# Altium schematic sheet Copy of EE209_Schematic.SchDoc: Wireless Energy Monitor
size A3; Author: Team XX; Organization: EE/CS 209 Class of 2022; Address1: Department of ECSE; Address2: The University of Auckland; Address3: 20 Symonds Street; Address4: Auckland, NZ; Revision: 1.0; SheetNumber: 1; SheetTotal: 1
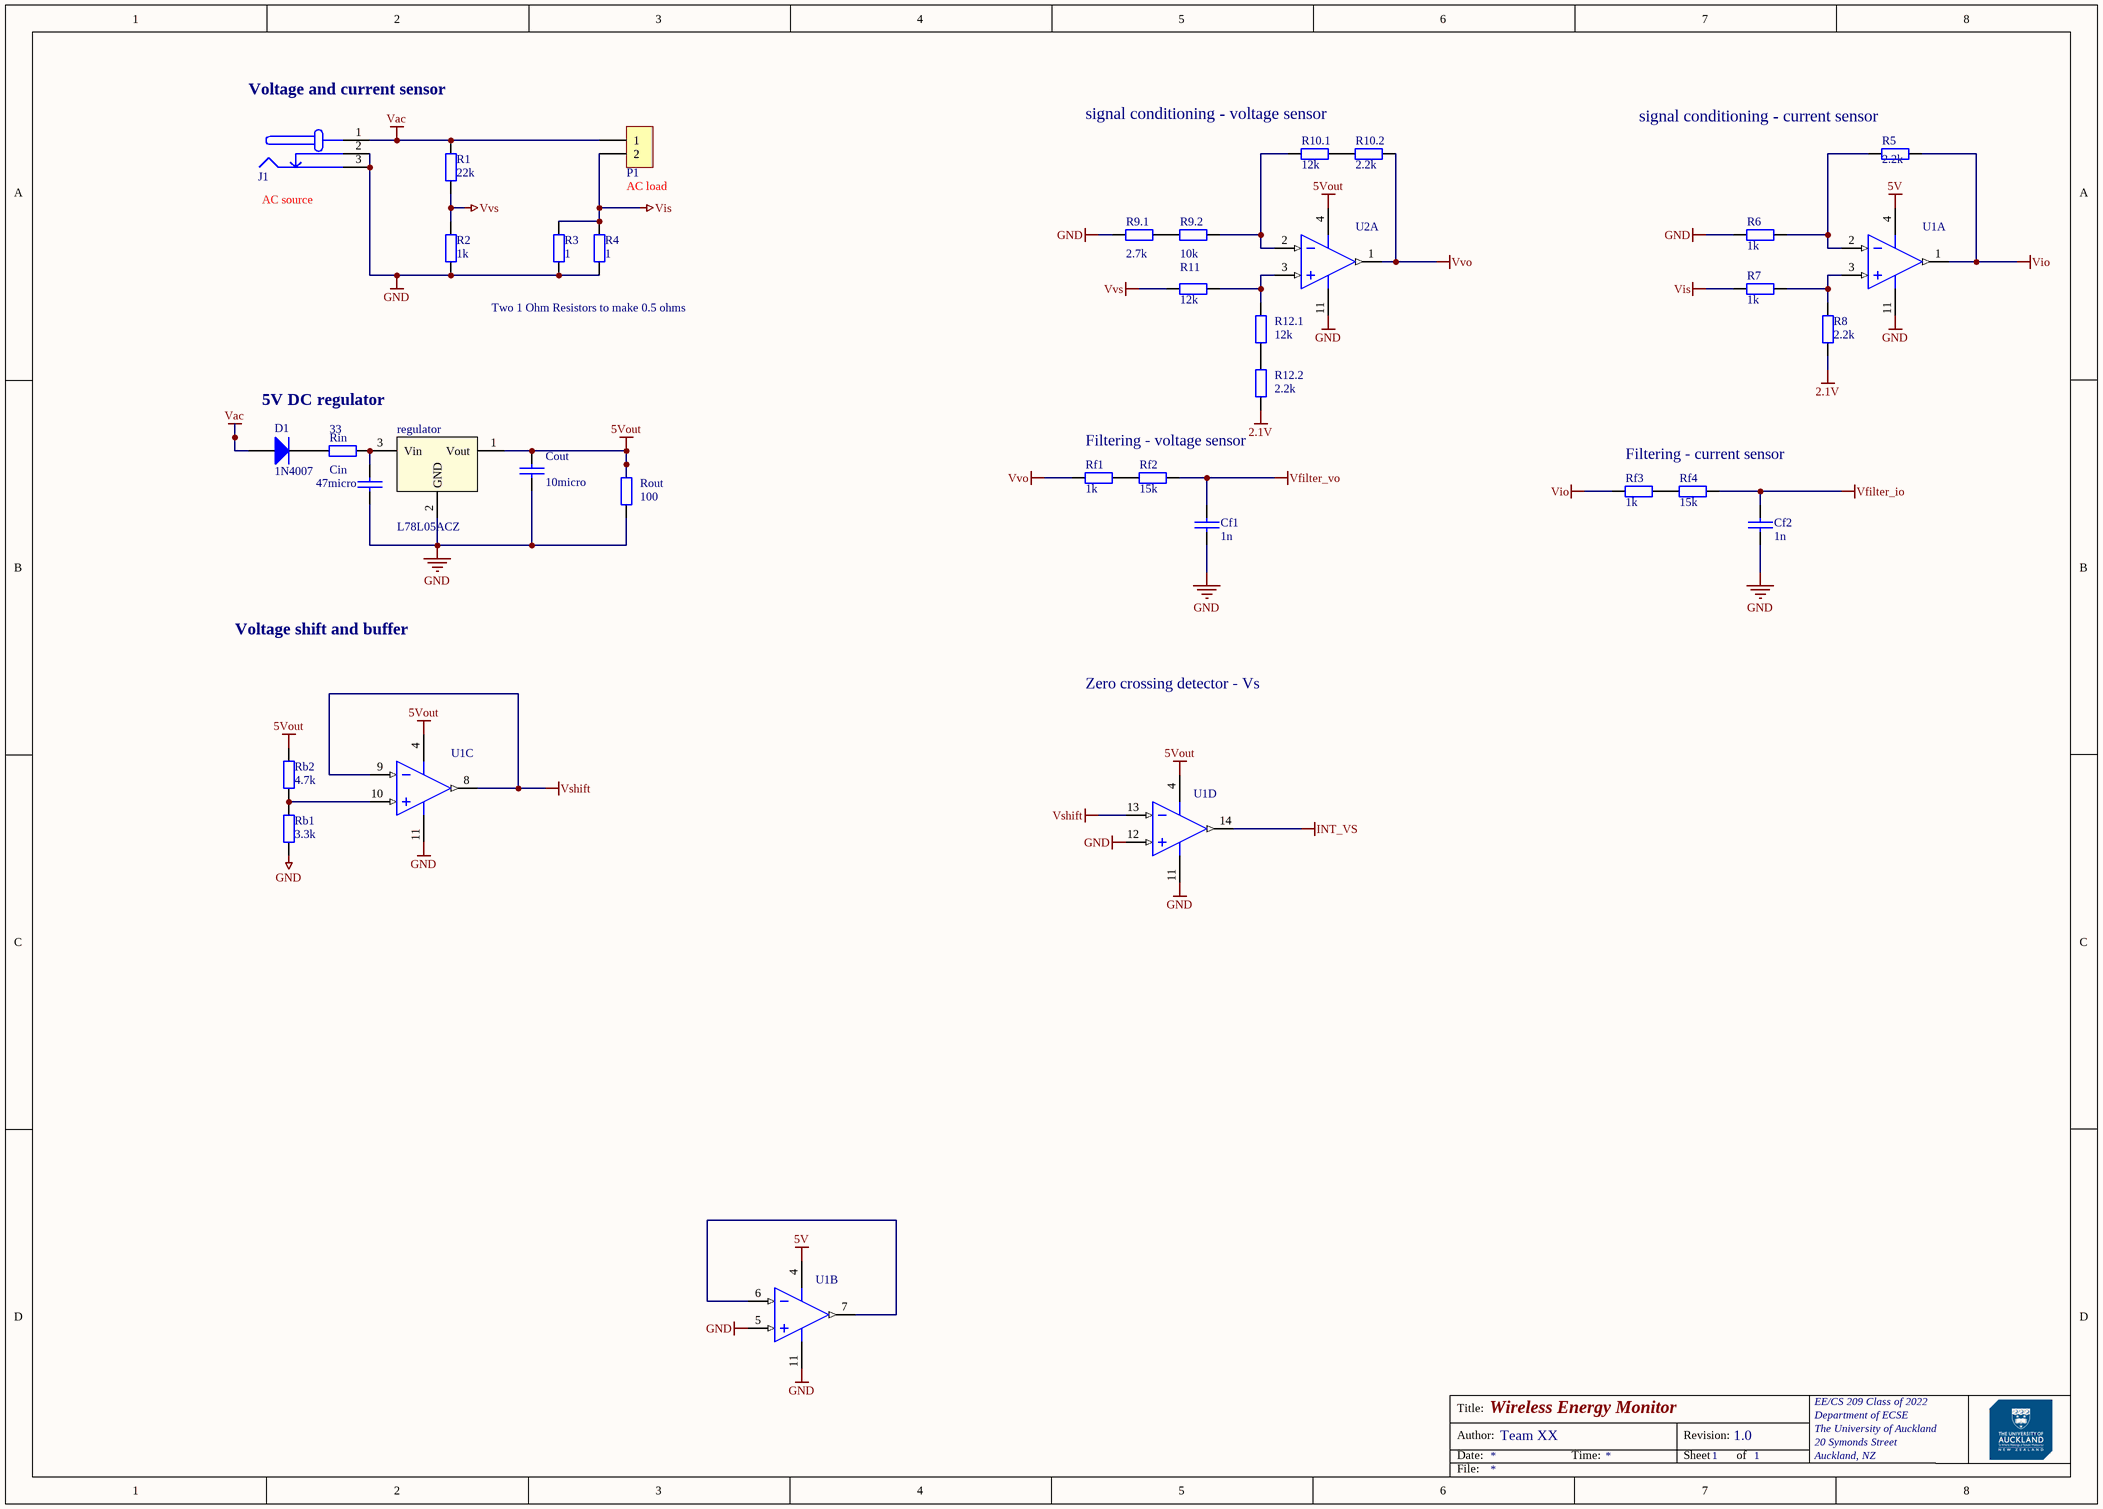
[diagram p0: Copy of EE209_Schematic.SchDoc]

## Parts
Cf1  1n  [CCAP-5P0]
Cf2  1n  [CCAP-5P0]
Cin  47micro  [CCAP-5P0]
Cout  10micro  [CCAP-5P0]
D1  1N4007  [1N4007-MFG]
J1  DC barrel jack  [AC-Socket]  (value not drawn)
P1  Dual Banana Plugs  [Dual Banana Plug]  (value not drawn)
R1  22k  [AXIAL-0.4]
R2  1k  [AXIAL-0.4]
R3  1  [AXIAL-0.4]
R4  1  [AXIAL-0.4]
R5  2.2k  [AXIAL-0.4]
R6  1k  [AXIAL-0.4]
R7  1k  [AXIAL-0.4]
R8  2.2k  [AXIAL-0.4]
R9.1  2.7k  [AXIAL-0.4]
R9.2  10k  [AXIAL-0.4]
R10.1  12k  [AXIAL-0.4]
R10.2  2.2k  [AXIAL-0.4]
R11  12k  [AXIAL-0.4]
R12.1  12k  [AXIAL-0.4]
R12.2  2.2k  [AXIAL-0.4]
Rb1  3.3k  [AXIAL-0.4]
Rb2  4.7k  [AXIAL-0.4]
regulator  L78L05ACZ  [TO-92]
Rf1  1k  [AXIAL-0.4]
Rf2  15k  [AXIAL-0.4]
Rf3  1k  [AXIAL-0.4]
Rf4  15k  [AXIAL-0.4]
Rin  33  [AXIAL-0.4]
Rout  100  [AXIAL-0.4]
U1  LM324  [DIP-14]  (value not drawn)  (parts A,B,C,D of 4)
U2  LM324  [DIP-14]  (value not drawn)  (part A of 4)

## Nets
2.1V: R8.1 R12.2.1
5V: U1.4(VDD)
5Vout: Cout.1 Rb2.2 regulator.1(Vout) Rout.2 U1.4(VDD) U2.4(VDD)
GND: Cf1.2 Cf2.2 Cin.2 Cout.2 J1.2(GND_ALT) J1.3(GND) R2.1 R3.1 R4.1 R6.1 R9.1.1 Rb1.1 regulator.2(GND) Rout.1 U1.5(VINB+) U1.11(VSS) U1.12(VIND+) U2.11(VSS)
INT_VS: U1.14(VOUTD)
Vac: D1.1(A) J1.1(VCC) P1.1 R1.2
Vfilter_io: Cf2.1 Rf4.2
Vfilter_vo: Cf1.1 Rf2.2
Vio: R5.2 Rf3.1 U1.1(VOUTA)
Vis: P1.2 R3.2 R4.2 R7.1
Vshift: U1.8(VOUTC) U1.9(VINC-) U1.13(VIND-)
Vvo: R10.2.2 Rf1.1 U2.1(VOUTA)
Vvs: R1.1 R2.2 R11.1
NetCin_1: Cin.1 regulator.3(Vin) Rin.2
NetD1_2: D1.2(K) Rin.1
NetR5_1: R5.1 R6.2 U1.2(VINA-)
NetR7_2: R7.2 R8.2 U1.3(VINA+)
NetR9.1_2: R9.1.2 R9.2.1
NetR9.2_2: R9.2.2 R10.1.1 U2.2(VINA-)
NetR10.1_2: R10.1.2 R10.2.1
NetR11_2: R11.2 R12.1.2 U2.3(VINA+)
NetR12.1_1: R12.1.1 R12.2.2
NetRb1_2: Rb1.2 Rb2.1 U1.10(VINC+)
NetRf1_2: Rf1.2 Rf2.1
NetRf3_2: Rf3.2 Rf4.1
NetU1_6: U1.6(VINB-) U1.7(VOUTB)

## Notes on the sheet
- Voltage and current sensor
- signal conditioning - voltage sensor
- (near R5) signal conditioning - current sensor
- (near J1) AC source
- (near P1) AC load
- Two 1 Ohm Resistors to make 0.5 ohms
- 5V DC regulator
- Filtering - voltage sensor
- Filtering - current sensor
- Voltage shift and buffer
- Zero crossing detector - Vs
- Title:
- Author:
- Date:
- Time:
- Revision:
- Sheet
- of
- File:

## Library data of the parts
Cf1 Cf2 Cin Cout = CerCap_TH_5P0: TH ceramic capacitor with 5mm pitch
  Cf1 Cf2 Cout: Value: *
  Cin: Value: 47micro
D1 = 1N4007_TH_4AX0: 1N4007 1000V standard axial diode; ComponentLink1URL: https://www.fairchildsemi.com/datasheets/1N/1N914.pdf; ComponentLink1Description: https://www.fairchildsemi.com/datasheets/1N/1N914.pdf; Supplier 1: Digi-Key; Supplier Part Number 1: 1N4007RLGOSCT-ND
J1 = AC_Input: DC barrel jack connection to AC source; Value: socket
P1 = AC_Output: Dual banana plugs connection to the AC load; LatestRevisionDate: 17-Jul-2002; LatestRevisionNote: Re-released for DXP Platform.; Publisher: Altium Limited
R1 R5 R8 R10.1 R12.1 = Res_TH_0AX4: Through hole resistor; Value: 100k; Published: 8-Jun-2000; LatestRevisionDate: 17-Jul-2002; LatestRevisionNote: Re-released for DXP Platform.; PackageReference: AXIAL-0.4; Publisher: Altium Limited; ComponentLink1Description: http://www.royalohm.com/pdf/product2017/PrecisionMetalMF.pdf
R2 = Res_TH_0AX4: Through hole resistor; Value: 1k2; Published: 8-Jun-2000; LatestRevisionDate: 17-Jul-2002; LatestRevisionNote: Re-released for DXP Platform.; PackageReference: AXIAL-0.4; Publisher: Altium Limited; ComponentLink1Description: http://www.royalohm.com/pdf/product2017/PrecisionMetalMF.pdf
R3 R4 R9.1 R9.2 R10.2 R12.2 Rb1 Rb2 Rf1-Rf4 Rin Rout = Res_TH_0AX4: Through hole resistor; Published: 8-Jun-2000; LatestRevisionDate: 17-Jul-2002; LatestRevisionNote: Re-released for DXP Platform.; PackageReference: AXIAL-0.4; Publisher: Altium Limited; ComponentLink1Description: http://www.royalohm.com/pdf/product2017/PrecisionMetalMF.pdf
  R3 R4: Value: 1
  R9.1 R10.2 R12.2 Rb1 Rb2 Rf1-Rf4 Rin Rout: Value: *
  R9.2: Value: 10k
R6 R7 R11 = Res_TH_0AX4: Through hole resistor; Value: 10k; Published: 8-Jun-2000; LatestRevisionDate: 17-Jul-2002; LatestRevisionNote: Re-released for DXP Platform.; PackageReference: AXIAL-0.4; Publisher: Altium Limited; ComponentLink1Description: http://www.royalohm.com/pdf/product2017/PrecisionMetalMF.pdf
regulator = L78L05_TH_TO92: Voltage Regulator 5V; Manufacturer: ON Semiconductor; Manufacturer Part Number: LM78L05ACZX; Output Configuration: Positive; Output Type: Fixed; Voltage - Input (Max): 30V; Current - Output: 100mA; PSRR: 80dB (120Hz); Protection Features: Over Temperature, Short Circuit; Supplier 1: Digi-Key; RoHS: RoHS Compliant; Category: Integrated Circuits (ICs); Stock 1: 7782; Pricing 1: 1=0.69, 10=0.517, 100=0.3226, 500=0.2207, 1000=0.16976 (NZD); Packaging: Cut Tape (CT); Part Status: Active; Voltage - Output (Min/Fixed): 5V; Voltage - Output (Max): -; Voltage Dropout (Max): -; Control Features: -; Operating Temperature: -40°C ~ 125°C; Mounting Type: Through Hole; Package / Case: TO-226-3, TO-92-3 (TO-226AA) (Formed Leads); Supplier Device Package: TO-92-3; Base Part Number: LM78L05; ComponentLink1URL: https://www.fairchildsemi.com/datasheets/MC/MC78L05A.pdf; ComponentLink1Description: https://www.fairchildsemi.com/datasheets/MC/MC78L05A.pdf; Supplier Part Number 1: LM78L05ACZXCT-ND
U1 U2 = LM324N_TH_DIP16: IC OPAMP GP 14DIP; Manufacturer: ON Semiconductor; Manufacturer Part Number: LM324N; Amplifier Type: General Purpose; Current - Supply: 1mA; Voltage - Supply, Single/Dual (±): 3 V ~ 32 V, ±1.5 V ~ 16 V; Supplier 1: Digi-Key; RoHS: RoHS Compliant; Category: Integrated Circuits (ICs); Stock 1: 2900; Pricing 1: 1=0.9, 10=0.775, 100=0.5789, 500=0.45482, 1000=0.35145 (NZD); Packaging: Tube; Part Status: Active; Output Type: -; Slew Rate: -; Operating Temperature: 0°C ~ 70°C; Mounting Type: Through Hole; Package / Case: 14-DIP (0.300", 7.62mm); Supplier Device Package: 14-DIP; Base Part Number: LM324; ComponentLink1URL: https://www.fairchildsemi.com/datasheets/LM/LM2902.pdf; ComponentLink1Description: https://www.fairchildsemi.com/datasheets/LM/LM2902.pdf; Supplier Part Number 1: LM324NFS-ND